# Altium schematic sheet 2101 Version.SchDoc
size A4; SheetNumber: 1; SheetTotal: 2
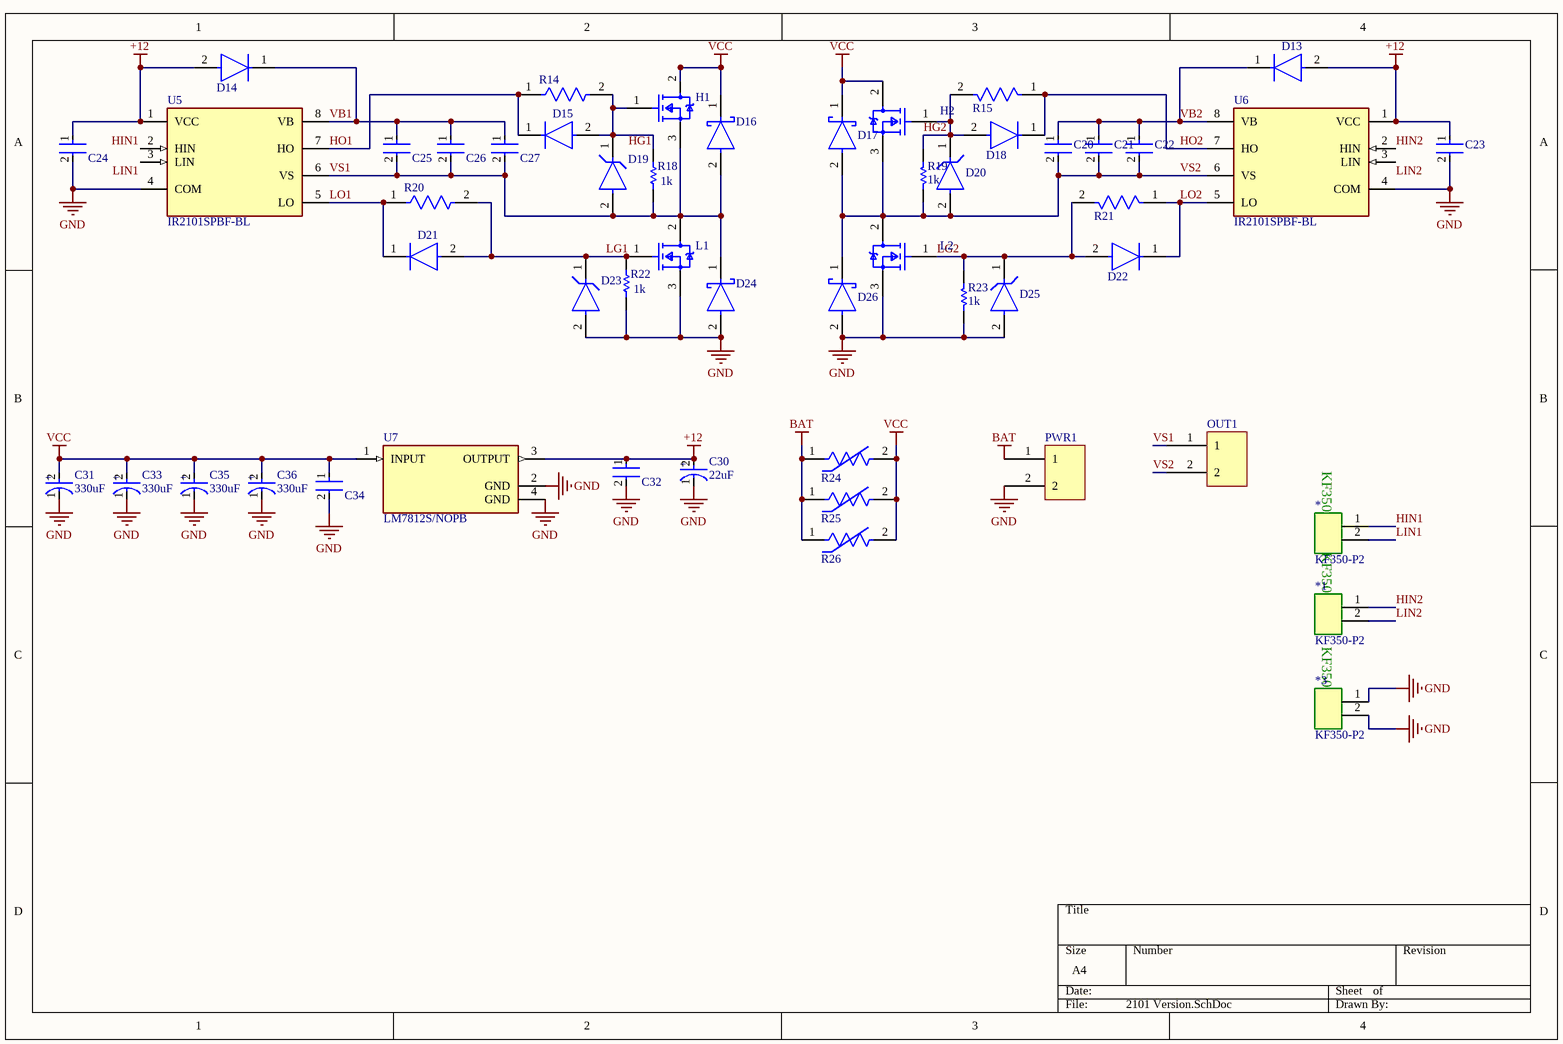
[diagram p0: 2101 Version.SchDoc]

## Parts
*  KF350-P2  [New footprint 1]
*1  KF350-P2  [New footprint 1]
*3  KF350-P2  [New footprint 1]
C20  12061C474KAT2A  [FP-1206-L_3_2_0_2-W_1_6_0-IPC_B]  (value not drawn)
C21  12061C474KAT2A  [FP-1206-L_3_2_0_2-W_1_6_0-IPC_B]  (value not drawn)
C22  12061C474KAT2A  [FP-1206-L_3_2_0_2-W_1_6_0-IPC_B]  (value not drawn)
C23  12065C104KAT2A  [FP-1206-L_3_2_0_2-W_1_6_0-IPC_B]  (value not drawn)
C24  12065C104KAT2A  [FP-1206-L_3_2_0_2-W_1_6_0-IPC_B]  (value not drawn)
C25  12061C474KAT2A  [FP-1206-L_3_2_0_2-W_1_6_0-IPC_B]  (value not drawn)
C26  12061C474KAT2A  [FP-1206-L_3_2_0_2-W_1_6_0-IPC_B]  (value not drawn)
C27  12061C474KAT2A  [FP-1206-L_3_2_0_2-W_1_6_0-IPC_B]  (value not drawn)
C30  value 22uF  [FP-SD-MFG]  (hidden comment: EEE-1VA220SP 22uF 50V)
C31  value 330uF  [FP-UWT1V331MNL1GS-MFG]  (hidden comment: UWT1V331MNL1GS 330uF 35V smd)
C32  12065C104KAT2A  [FP-1206-L_3_2_0_2-W_1_6_0-IPC_B]  (value not drawn)
C33  value 330uF  [FP-UWT1V331MNL1GS-MFG]  (hidden comment: UWT1V331MNL1GS 330uF 35V smd)
C34  12065C104KAT2A  [FP-1206-L_3_2_0_2-W_1_6_0-IPC_B]  (value not drawn)
C35  value 330uF  [FP-UWT1V331MNL1GS-MFG]  (hidden comment: UWT1V331MNL1GS 330uF 35V smd)
C36  value 330uF  [FP-UWT1V331MNL1GS-MFG]  (hidden comment: UWT1V331MNL1GS 330uF 35V smd)
D13  MURS120T3G  [FP-403A-03-MFG]  (value not drawn)
D14  MURS120T3G  [FP-403A-03-MFG]  (value not drawn)
D15  MURS120T3G  [FP-403A-03-MFG]  (value not drawn)
D16  SS34-E3/57T  [FP-95402-MFG]  (value not drawn)
D17  SS34-E3/57T  [FP-95402-MFG]  (value not drawn)
D18  MURS120T3G  [FP-403A-03-MFG]  (value not drawn)
D19  TZMC3V3-GS08  [FP-6_560-5005_01-4-MFG]  (value not drawn)
D20  TZMC3V3-GS08  [FP-6_560-5005_01-4-MFG]  (value not drawn)
D21  MURS120T3G  [FP-403A-03-MFG]  (value not drawn)
D22  MURS120T3G  [FP-403A-03-MFG]  (value not drawn)
D23  TZMC3V3-GS08  [FP-6_560-5005_01-4-MFG]  (value not drawn)
D24  SS34-E3/57T  [FP-95402-MFG]  (value not drawn)
D25  TZMC3V3-GS08  [FP-6_560-5005_01-4-MFG]  (value not drawn)
D26  SS34-E3/57T  [FP-95402-MFG]  (value not drawn)
H1  IRF3205STRLPBF  [FP-PG-TO263-3-MFG]  (value not drawn)
H2  IRF3205STRLPBF  [FP-PG-TO263-3-MFG]  (value not drawn)
L1  IRF3205STRLPBF  [FP-PG-TO263-3-MFG]  (value not drawn)
L2  IRF3205STRLPBF  [FP-PG-TO263-3-MFG]  (value not drawn)
OUT1  2 pin terminal klemens  [New footprint 1]  (value not drawn)
PWR1  2 pin terminal klemens  [New footprint 1]  (value not drawn)
R14  RC1206JR-0710RL  [FP-RC1206-0_65-MFG]  (value not drawn)
R15  RC1206JR-0710RL  [FP-RC1206-0_65-MFG]  (value not drawn)
R18  value 1k  [RESC3116X70X50ML13T20]  (hidden comment: Resistor 1k +/-1% 1206 250 mW)
R19  value 1k  [RESC3116X70X50ML13T20]  (hidden comment: Resistor 1k +/-1% 1206 250 mW)
R20  RC1206JR-0710RL  [FP-RC1206-0_65-MFG]  (value not drawn)
R21  RC1206JR-0710RL  [FP-RC1206-0_65-MFG]  (value not drawn)
R22  value 1k  [RESC3116X70X50ML13T20]  (hidden comment: Resistor 1k +/-1% 1206 250 mW)
R23  value 1k  [RESC3116X70X50ML13T20]  (hidden comment: Resistor 1k +/-1% 1206 250 mW)
R24  20mm Body 7.5mm pitch Thermistor  [FP-NTPAD-MFG]  (value not drawn)
R25  20mm Body 7.5mm pitch Thermistor  [FP-NTPAD-MFG]  (value not drawn)
R26  20mm Body 7.5mm pitch Thermistor  [FP-NTPAD-MFG]  (value not drawn)
U5  IR2101SPBF-BL  [FP-PG-DSO-8-MFG]
U6  IR2101SPBF-BL  [FP-PG-DSO-8-MFG]
U7  LM7812S/NOPB  [FP-KTT0003B-MFG]

## Nets
+12: C23.1 C24.1 C30.2(A) C32.1 D13.2(A) D14.2(A) U5.1(VCC) U6.1(VCC) U7.3(OUTPUT)
BAT: PWR1.1 R24.1 R25.1 R26.1
GND: *3.1 *3.2 C23.2 C24.2 C30.1(C) C31.1(C) C32.2 C33.1(C) C34.2 C35.1(C) C36.1(C) D23.2(A) D24.2(A) D25.2(A) D26.2(A) L1.3(S) L2.3(S) PWR1.2 R22.2 R23.2 U5.4(COM) U6.4(COM) U7.2(GND) U7.4(GND)
VCC: C31.2(A) C33.2(A) C34.1 C35.2(A) C36.2(A) D16.1(C) D17.1(C) H1.2(D) H2.2(D) R24.2 R25.2 R26.2 U7.1(INPUT)
HG1: D15.2(A) D19.1(C) H1.1(G) R14.2 R18.1
HG2: D18.2(A) D20.1(C) H2.1(G) R15.2 R19.1
HIN1: *.1 U5.2(HIN)
HIN2: *1.1 U6.2(HIN)
HO1: D15.1(C) R14.1 U5.7(HO)
HO2: D18.1(C) R15.1 U6.7(HO)
LG1: D21.2(A) D23.1(C) L1.1(G) R20.2 R22.1
LG2: D22.2(A) D25.1(C) L2.1(G) R21.2 R23.1
LIN1: *.2 U5.3(LIN)
LIN2: *1.2 U6.3(LIN)
LO1: D21.1(C) R20.1 U5.5(LO)
LO2: D22.1(C) R21.1 U6.5(LO)
VB1: C25.1 C26.1 C27.1 D14.1(C) U5.8(VB)
VB2: C20.1 C21.1 C22.1 D13.1(C) U6.8(VB)
VS1: C25.2 C26.2 C27.2 D16.2(A) D19.2(A) D24.1(C) H1.3(S) L1.2(D) OUT1.1 R18.2 U5.6(VS)
VS2: C20.2 C21.2 C22.2 D17.2(A) D20.2(A) D26.1(C) H2.3(S) L2.2(D) OUT1.2 R19.2 U6.6(VS)

## Notes on the sheet
- (in symbol CMP-002-00078-2) KF350
- (in symbol CMP-000023-1) +
- (in symbol CMP-000026-1) +

## Library data of the parts
* *1 *3 = CMP-002-00078-2: 3.5mm mini klemens
C20-C22 C25-C27 = CMP-000013-1: 1206 470 nF 100 V ±10 % Tolerance X7R Surface Mount Multilayer Ceramic Capacitor
C23 C24 C32 C34 = CMP-001-00084-1: Ceramic capacitor SMD-1206 100nF /50V X7R# K +-10%, AVX, RoHS, /4000 reel/
C30 = CMP-000026-1: Cap Aluminum 22uF 35V 20% (6.3 X 5.4mm) SMD 60mA 2000h 85 C T/R; Case/Package: Radial; Diameter: 6.3mm; Construction: Cylindrical
C31 C33 C35 C36 = CMP-000023-1: Aluminum Electrolytic Capacitor, 330uF 35 V, WT Series 1000h 10 (Dia.) x 10mm; Diameter: 10mm; Construction: Cylindrical; Case/Package: Radial
D13-D15 D18 D21 D22 = CMP-004-00033-1: VR=200V IF=2A Trr=35ns
D16 D17 D24 D26 = CMP-000005-2: DIODE SCHOTTKY 40V 3A DO214AB
D19 D20 D23 D25 = CMP-000009-1: DIODE ZENER 3.3V 500MW SOD80
H1 H2 L1 L2 = CMP-013-00038-1: MOSFET N-CH 55V 110A D2PAK
OUT1 PWR1 = CMP-002-00072-2: 2 pin terminal klemens pin aralığı 200 mil
R14 R15 R20 R21 = CMP-000008-1: Res General Purpose Thick Film 1206 10 Ohm 5% 1/4W ±200ppm/°C Molded SMD Paper T/R
R18 R19 R22 R23 = CMP-009-00011-5: Chip Resistor, 1 KOhm, +/- 1%, 0.25 W, -55 to 155 degC, 1206 (3216 Metric); Voltage Rating: 200V; Power: 250mW; Max Operating Temperature: 155°C; Mounting Technology: SM; Tolerance: 1%; Case/Package: 1206; RoHS Compliant: True; Min Operating Temperature: -55°C; Pins: 2
R24-R26 = CMP-009-00184-2
U5 U6 = CMP-000015-1: MOSFET DRVR 600V 0.36A 2-OUT Hi/Lo Side Non-Inv 8-Pin SOIC
U7 = CMP-04917-000197-1: IC REG LINEAR 12V 1.5A; Quiescent Current: 8mA; Dropout Voltage: 2V; Lead Free: Contains Lead; RoHS Compliant: Yes; Min Operating Temperature: 0°C; Case/Package: TO-263; Max Operating Temperature: 125°C